# Altium schematic sheet pwr_socket.SchDoc
size A4
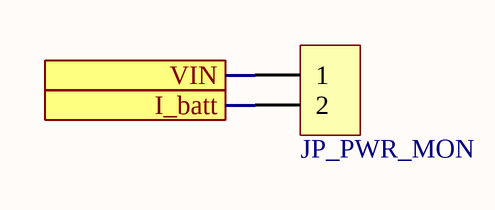
[diagram p0: pwr_socket.SchDoc]

## Parts
JP_PWR_MON  HDR-1X2  [HDR2.54-M-LI-2P]  (value not drawn)

## Ports
I_batt, VIN

## Nets
I_batt: JP_PWR_MON.2 ; port I_batt
VIN: JP_PWR_MON.1 ; port VIN

## Library data of the parts
JP_PWR_MON = Header 2: 2P接插件; 版权归属: 源创客; BOM名称: 2P接插件; 学习资源: www.ooocke.com